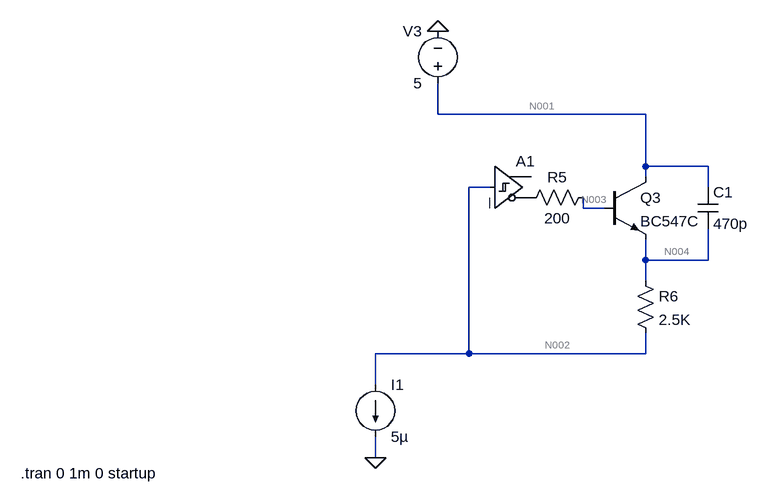
[diagram p0: schematic test_without.asc]
test_without.asc, the LTspice schematic file:
Version 4
SHEET 1 1188 680
WIRE 672 0 672 -48
WIRE 992 0 672 0
WIRE 992 80 992 0
WIRE 1088 80 992 80
WIRE 992 96 992 80
WIRE 752 112 720 112
WIRE 1088 112 1088 80
WIRE 896 144 896 128
WIRE 928 144 896 144
WIRE 992 224 992 192
WIRE 1088 224 1088 176
WIRE 1088 224 992 224
WIRE 992 256 992 224
WIRE 720 368 720 112
WIRE 720 368 576 368
WIRE 992 368 992 336
WIRE 992 368 720 368
WIRE 576 416 576 368
WIRE 576 528 576 496
FLAG 672 -128 0
FLAG 576 528 0
SYMBOL Digital\\schmitt 752 48 R0
WINDOW 3 0 0 Invisible 2
SYMATTR InstName A1
SYMATTR Value VHigh=4 Vt=1.2 Vh=.4 Trise=.1u Tfall=.1u
SYMBOL npn 928 96 R0
SYMATTR InstName Q3
SYMATTR Value BC547C
SYMBOL res 912 112 R90
WINDOW 0 0 56 VBottom 2
WINDOW 3 32 56 VTop 2
SYMATTR InstName R5
SYMATTR Value 200
SYMBOL cap 1072 112 R0
SYMATTR InstName C1
SYMATTR Value 470p
SYMBOL res 976 240 R0
SYMATTR InstName R6
SYMATTR Value 2.5K
SYMBOL voltage 672 -32 R180
WINDOW 0 24 96 Left 2
WINDOW 3 24 16 Left 2
WINDOW 123 0 0 Left 2
WINDOW 39 0 0 Left 2
SYMATTR InstName V3
SYMATTR Value 5
SYMBOL current 576 416 R0
WINDOW 123 0 0 Left 2
WINDOW 39 0 0 Left 2
SYMATTR InstName I1
SYMATTR Value 5µ
TEXT 30 552 Left 2 !.tran 0 1m 0 startup

The netlist it stands for:
* test_without.asc
A1 N002 0 0 0 0 P001 0 0 SCHMITT VHigh=4 Vt=1.2 Vh=.4 Trise=.1u Tfall=.1u
Q3 N001 N003 N004 0 BC547C
R5 N003 P001 200
C1 N001 N004 470p
R6 N004 N002 2.5K
V3 N001 0 5
I1 N002 0 5µ
.model NPN NPN
.model PNP PNP
.lib standard.bjt
.tran 0 1m 0 startup
.backanno
.end

* Results of the author's LTspice run, read from the files saved beside the schematic
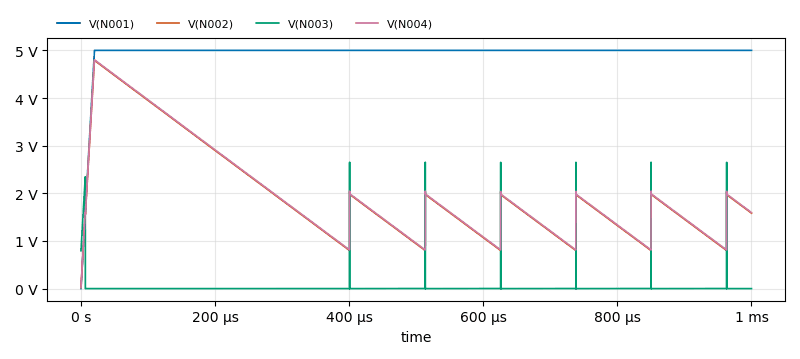
[diagram p1: Transient Analysis of test_without.asc, plotted from the saved traces]
* Transient Analysis, 1 run:
*   V(N001): min 0 V, max 5 V, average 4.95 V, rms 4.967 V, last 5 V
*   V(N002): min 22.87 mV, max 4.79 V, average 1.957 V, rms 2.265 V, last 1.584 V
*   V(N003): min -4.155 mV, max 2.652 V, average 11.09 mV, rms 138.7 mV, last -9.471 µV
*   V(N004): min 22.87 mV, max 4.803 V, average 1.97 V, rms 2.275 V, last 1.597 V